# EAGLE board M18BR_V1_2 (EAGLE 7.4.0), part 1 of 2
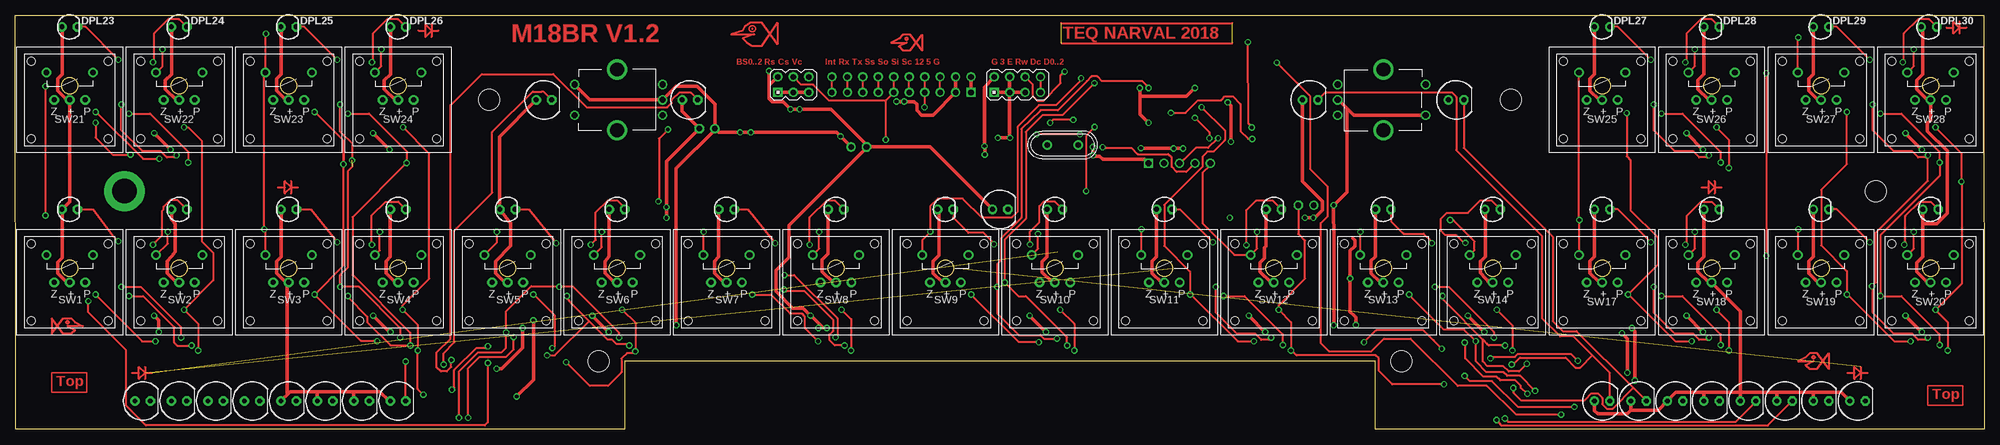
[diagram p3: board, top side]
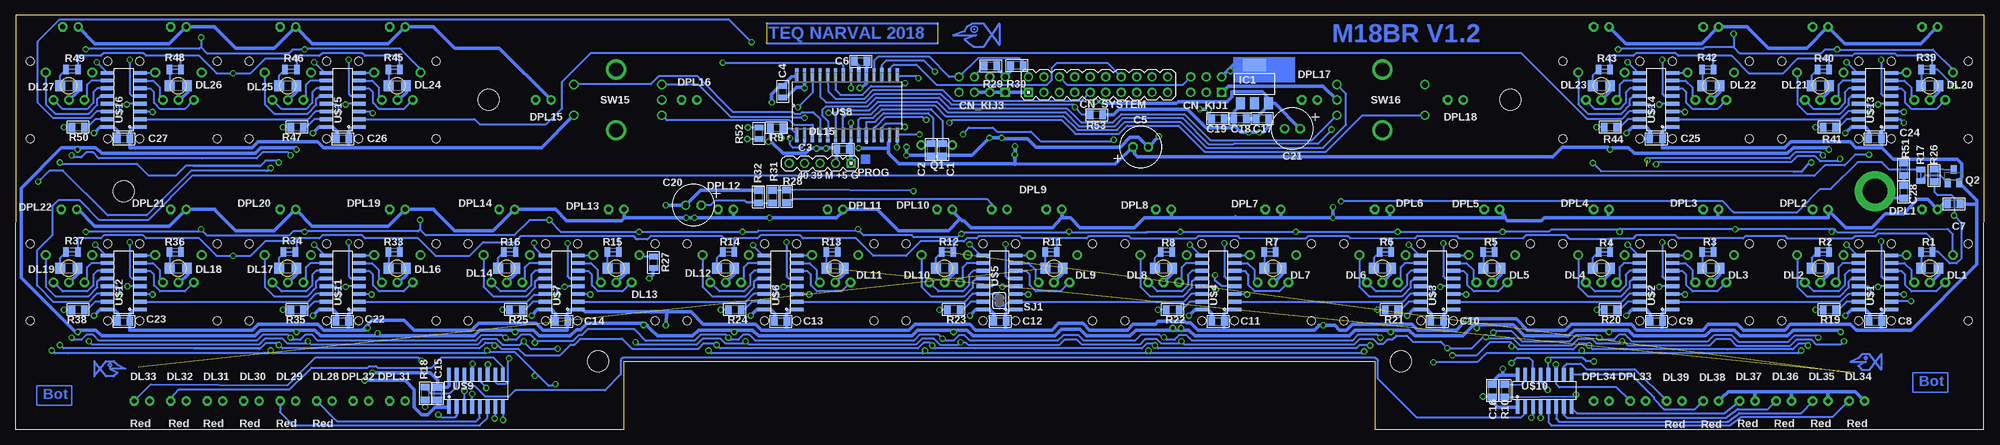
[diagram p4: board, bottom side, seen from below]

Size 323.81 x 68.11 mm. Coordinates in mm from the lower left corner, seen from the top.
Outline: 0,68.1 323.68,68.1 323.81,0 223.72,0 223.72,11.18 100.22,11.18 100.22,0 0.13,0 0,68.1
Outline: circle at 188.97,26.53 radius 1.33
Outline: circle at 170.97,26.53 radius 1.33
Outline: circle at 206.97,26.53 radius 1.33
Outline: circle at 224.97,26.53 radius 1.33
Outline: circle at 242.97,26.53 radius 1.33
Outline: circle at 152.97,26.53 radius 1.33
Outline: circle at 134.97,26.53 radius 1.33
Outline: circle at 116.97,26.53 radius 1.33
Outline: circle at 98.97,26.53 radius 1.33
Outline: circle at 80.97,26.53 radius 1.33
Outline: circle at 62.97,26.53 radius 1.33
Outline: circle at 44.97,26.53 radius 1.33
Outline: circle at 26.97,26.53 radius 1.33
Outline: circle at 8.97,26.53 radius 1.33
Outline: circle at 260.97,26.53 radius 1.33
Outline: circle at 278.97,26.53 radius 1.33
Outline: circle at 296.97,26.53 radius 1.33
Outline: circle at 314.97,26.53 radius 1.33
Outline: circle at 296.97,56.53 radius 1.33
Outline: circle at 8.97,56.53 radius 1.33
Copper layers (1*16): Top 0.035mm / dielectric 1.5mm / Bottom 0.035mm
Design rules "default *": minimum track width 10mil, minimum drill 23mil, track to track 12mil, track to pad 12mil, pad to pad 12mil, via to via 12mil, smd to smd 0mil, copper to edge 12mil, drill to drill 8mil, minimum pad ring 10mil, minimum via ring 8mil, stop-mask expansion 0mil, vias tented up to drill 0mil, thermal gap 10mil
Net classes: 0 default: width 0.305 mm, clearance 0.305 mm; 1 Tap: width 0.406 mm, clearance 0.305 mm
Holes 3.5 mm at 305.97,39.18 95.97,11.18 77.97,54.18 227.97,11.18 245.97,54.18
tRestrict: area 302.5,35.7 to 309.5,42.7; area 92.5,7.7 to 99.5,14.7; area 74.5,50.7 to 81.5,57.7; area 224.5,7.7 to 231.5,14.7; area 242.5,50.7 to 249.5,57.7
bRestrict: area 302.5,35.7 to 309.5,42.7; area 92.5,7.7 to 99.5,14.7; area 74.5,50.7 to 81.5,57.7; area 224.5,7.7 to 231.5,14.7; area 242.5,50.7 to 249.5,57.7

## Footprints (pad centres in the part's own frame; a part is rotated, then mirrored left to right if it is on the bottom)
R_0805_NAGY = smd 1.1 x 1.5: 1 -1.052,0; 2 1.052,0
R0805 = smd 0.9 x 1.5: 1 -0.953,0; 2 0.953,0
C_EL1RASZT07 = drill 0.914 pad 1.524 octagon: P+ 1.27,0 | drill 0.914 pad 1.524: P- -1.27,0
TESTCSAVAR = drill 4 pad 6.6: P$1 0,0
PIN03_2 = drill 0.914 pad 1.524 square: 1 -2.54,0 | drill 0.914 pad 1.524: 2 -2.54,2.54; 3 0,0; 4 0,2.54; 5 2.54,0; 6 2.54,2.54
PIN04_2 = drill 0.914 pad 1.524 square: 1 -2.54,0 | drill 0.914 pad 1.524: 2 -2.54,2.54; 3 0,0; 4 0,2.54; 5 2.54,0; 6 2.54,2.54; 7 5.08,0; 8 5.08,2.54
PIN10_2 = drill 0.914 pad 1.524 square: 1 -10.16,0 | drill 0.914 pad 1.524: 2 -10.16,2.54; 3 -7.62,0; 4 -7.62,2.54; 5 -5.08,0; 6 -5.08,2.54; 7 -2.54,0; 8 -2.54,2.54; 9 0,0; 10 0,2.54; 11 2.54,0; 12 2.54,2.54; 13 5.08,0; 14 5.08,2.54; 15 7.62,0; 16 7.62,2.54; 17 10.16,0; 18 10.16,2.54; 19 12.7,0; 20 12.7,2.54
R1206 = smd 1.6 x 1.803: 1 -1.422,0; 2 1.422,0
LED5MM = drill 0.813 pad 1.524: A -1.27,0 | drill 0.813 pad 1.524 octagon: K 1.27,0
LED3MM = drill 0.813 pad 1.524: A -1.27,0 | drill 0.813 pad 1.524 octagon: K 1.27,0
SOT223 = smd 1.5 x 2: 1 -2.3,-3.15; 2 0,-3.15; 3 2.3,-3.15 | smd 3.8 x 2: 4 0,3.15
PIN05_1 = drill 1.016 square: 1 -5.08,0 | drill 1.016: 2 -2.54,0; 3 0,0; 4 2.54,0; 5 5.08,0
XTAL_QS = drill 0.914 pad 1.524: 1 -2.54,0; 2 2.54,0
SOT23 = smd 1 x 1.4: 1 -0.95,-1.1; 2 0.95,-1.1; 3 0,1.1
R0805_C = smd 0.9 x 1.5: 1 -0.953,0; 2 0.953,0
SJ = smd 0.508 x 0.508: 1 -0.762,0; 2 0.762,0; 3 -0.762,0; 4 0.762,0
SPG2_3LED = drill 0.95 pad 1.6: G1 -3.81,4.5; G2 3.81,4.5 | drill 0.85 pad 1.6: LED+ 0,0; P- 2.54,0; Z- -2.54,0 | hole 1.35: 6.35,6.35; -6.35,6.35; -6.35,-6.35; 6.35,-6.35
ROTARY_ENC_SLIM = drill 1.016: A 7.493,-2.54; B 7.493,2.54; C 7.493,0; SW+ -6.985,2.54; SW- -6.985,-2.54 | drill 2.286: P$3 0,5; P$4 0,-5
SO16 = smd 0.6 x 2.2: 1 -4.445,-2.695; 2 -3.175,-2.695; 3 -1.905,-2.695; 4 -0.635,-2.695; 5 0.635,-2.695; 6 1.905,-2.695; 7 3.175,-2.695; 8 4.445,-2.695; 9 4.445,2.695; 10 3.175,2.695; 11 1.905,2.695; 12 0.635,2.695; 13 -0.635,2.695; 14 -1.905,2.695; 15 -3.175,2.695; 16 -4.445,2.695
SOIC28_NAGY = smd 2.381 x 0.533: 1 -4.899,8.255; 2 -4.899,6.985; 3 -4.899,5.715; 4 -4.899,4.445; 5 -4.899,3.175; 6 -4.899,1.905; 7 -4.899,0.635; 8 -4.899,-0.635; 9 -4.899,-1.905; 10 -4.899,-3.175; 11 -4.899,-4.445; 12 -4.899,-5.715; 13 -4.899,-6.985; 14 -4.899,-8.255; 15 4.899,-8.255; 16 4.899,-6.985; 17 4.999,-5.715; 18 4.899,-4.445; 19 4.899,-3.175; 20 4.899,-1.905; 21 4.899,-0.635; 22 4.899,0.635; 23 4.899,1.905; 24 4.899,3.175; 25 4.899,4.445; 26 4.899,5.715; 27 4.899,6.985; 28 4.899,8.255

## Placement (x,y rotation side)
C1  22  [R_0805_NAGY]  171.29,45.98 270 bottom
C2  22  [R_0805_NAGY]  173.2,45.98 270 bottom
C3  100n  [R_0805_NAGY]  187.64,46.04 0 bottom
C4  100n  [R0805]  197.64,55.5 270 bottom
C5  100u  [C_EL1RASZT07]  138.73,46.45 180 bottom
C6  1u  [R_0805_NAGY]  184.78,60.52 0 bottom
C7  100n  [R_0805_NAGY]  4.99,37.12 0 bottom
C8  100n  [R_0805_NAGY]  17.91,17.76 0 bottom
C9  100n  [R_0805_NAGY]  53.94,17.76 0 bottom
C10  100n  [R_0805_NAGY]  89.98,17.76 0 bottom
C11  100n  [R_0805_NAGY]  126.02,17.76 0 bottom
C12  100n  [R_0805_NAGY]  161.89,17.76 0 bottom
C13  100n  [R_0805_NAGY]  197.93,17.76 0 bottom
C14  100n  [R_0805_NAGY]  233.97,17.76 0 bottom
C15  100n  [R_0805_NAGY]  254.38,5.9 270 bottom
C16  100n  [R_0805_NAGY]  80.89,6.38 270 bottom
C17  100n  [R_0805_NAGY]  118.74,51.06 180 bottom
C18  10u  [R_0805_NAGY]  122.39,51.06 0 bottom
C19  100n  [R_0805_NAGY]  126.04,51.06 180 bottom
C20  220u  [C_EL1RASZT07]  212.28,36.86 0 bottom
C21  100u  [C_EL1RASZT07]  113.79,49.46 0 bottom
C22  100n  [R_0805_NAGY]  270.02,17.76 0 bottom
C23  100n  [R_0805_NAGY]  305.97,17.76 0 bottom
C24  100n  [R_0805_NAGY]  17.97,47.78 0 bottom
C25  100n  [R_0805_NAGY]  53.97,47.78 0 bottom
C26  100n  [R_0805_NAGY]  269.97,47.78 0 bottom
C27  100n  [R_0805_NAGY]  305.97,47.78 0 bottom
C28  100n  [R_0805_NAGY]  13.22,39.06 90 bottom
CN1  TESTCSAVAR  [TESTCSAVAR]  17.97,39.18 0 top
CN_KIJ1  Vc Cs Rs Bs2..0  [PIN03_2]  127.97,55.43 0 top
CN_KIJ3  D2..0 Dc Rw E 3 G  [PIN04_2]  163.53,55.43 0 top
CN_SYSTEM  Int Rx Tx Ss So Si Sc 12 5 G  [PIN10_2]  147.02,55.43 0 bottom
DL1  LED1206  [R1206]  8.97,26.53 180 bottom
DL2  LED1206  [R1206]  26.97,26.53 180 bottom
DL3  LED1206  [R1206]  44.97,26.53 180 bottom
DL4  LED1206  [R1206]  62.97,26.53 180 bottom
DL5  LED1206  [R1206]  80.97,26.53 180 bottom
DL6  LED1206  [R1206]  98.97,26.53 180 bottom
DL7  LED1206  [R1206]  116.97,26.53 180 bottom
DL8  LED1206  [R1206]  134.97,26.53 180 bottom
DL9  LED1206  [R1206]  152.97,26.53 180 bottom
DL10  LED1206  [R1206]  170.97,26.53 180 bottom
DL11  LED1206  [R1206]  188.97,26.53 180 bottom
DL12  LED1206  [R1206]  206.97,26.53 180 bottom
DL13  LED1206  [R1206]  224.97,26.53 180 bottom
DL14  LED1206  [R1206]  242.97,26.53 180 bottom
DL15  PWR  [LED5MM]  161.97,36.18 0 top
DL16  LED1206  [R1206]  260.97,26.53 180 bottom
DL17  LED1206  [R1206]  278.97,26.53 180 bottom
DL18  LED1206  [R1206]  296.97,26.53 180 bottom
DL19  LED1206  [R1206]  314.97,26.53 180 bottom
DL20  LED1206  [R1206]  8.97,56.53 180 bottom
DL21  LED1206  [R1206]  26.97,56.53 180 bottom
DL22  LED1206  [R1206]  44.97,56.53 180 bottom
DL23  LED1206  [R1206]  62.97,56.53 180 bottom
DL24  LED1206  [R1206]  260.97,56.53 180 bottom
DL25  LED1206  [R1206]  278.97,56.53 180 bottom
DL26  LED1206  [R1206]  296.97,56.53 180 bottom
DL27  LED1206  [R1206]  314.97,56.53 180 bottom
DL28  Red  [LED5MM]  272.97,4.68 0 top
DL29  Red  [LED5MM]  278.97,4.68 0 top
DL30  Red  [LED5MM]  284.97,4.68 0 top
DL31  Red  [LED5MM]  290.97,4.68 0 top
DL32  Red  [LED5MM]  296.97,4.68 0 top
DL33  Red  [LED5MM]  302.97,4.68 0 top
DL34  Red  [LED5MM]  20.97,4.68 0 top
DL35  Red  [LED5MM]  26.97,4.68 0 top
DL36  Red  [LED5MM]  32.97,4.68 0 top
DL37  Red  [LED5MM]  38.97,4.68 0 top
DL38  Red  [LED5MM]  44.97,4.68 0 top
DL39  Red  [LED5MM]  50.97,4.68 0 top
DPL1  LED3MM  [LED3MM]  8.97,36.18 0 top
DPL2  LED3MM  [LED3MM]  26.97,36.18 0 top
DPL3  LED3MM  [LED3MM]  44.97,36.18 0 top
DPL4  LED3MM  [LED3MM]  62.97,36.18 0 top
DPL5  LED3MM  [LED3MM]  80.97,36.18 0 top
DPL6  LED3MM  [LED3MM]  98.97,36.18 0 top
DPL7  LED3MM  [LED3MM]  116.97,36.18 0 top
DPL8  LED3MM  [LED3MM]  134.97,36.18 0 top
DPL9  LED3MM  [LED3MM]  152.97,36.18 0 top
DPL10  LED3MM  [LED3MM]  170.97,36.18 0 top
DPL11  LED3MM  [LED3MM]  188.97,36.18 0 top
DPL12  LED3MM  [LED3MM]  206.97,36.18 0 top
DPL13  LED3MM  [LED3MM]  224.97,36.18 0 top
DPL14  LED3MM  [LED3MM]  242.97,36.18 0 top
DPL15  LED5MM  [LED5MM]  236.97,54.18 0 top
DPL16  LED5MM  [LED5MM]  212.97,54.18 0 top
DPL17  LED5MM  [LED5MM]  110.97,54.18 0 top
DPL18  LED5MM  [LED5MM]  86.97,54.18 0 top
DPL19  LED3MM  [LED3MM]  260.97,36.18 0 top
DPL20  LED3MM  [LED3MM]  278.97,36.18 0 top
DPL21  LED3MM  [LED3MM]  296.97,36.18 0 top
DPL22  LED3MM  [LED3MM]  314.97,36.18 0 top
DPL23  LED3MM  [LED3MM]  8.97,66.18 0 top
DPL24  LED3MM  [LED3MM]  26.97,66.18 0 top
DPL25  LED3MM  [LED3MM]  44.97,66.18 0 top
DPL26  LED3MM  [LED3MM]  62.97,66.18 0 top
DPL27  LED3MM  [LED3MM]  260.97,66.18 0 top
DPL28  LED3MM  [LED3MM]  278.97,66.18 0 top
DPL29  LED3MM  [LED3MM]  296.97,66.18 0 top
DPL30  LED3MM  [LED3MM]  314.72,66.18 0 top
DPL31  LED5MM  [LED5MM]  260.97,4.68 0 top
DPL32  LED5MM  [LED5MM]  266.97,4.68 0 top
DPL33  LED5MM  [LED5MM]  56.97,4.68 0 top
DPL34  LED5MM  [LED5MM]  62.97,4.68 0 top
IC1  LD117AS33TR  [SOT223]  120.01,56.77 0 bottom
PROG  40 39 M +5 G  [PIN05_1]  191.45,43.75 180 bottom
Q1  20MHz  [XTAL_QS]  172.27,46.77 180 top
Q2  BC846BSMD  [SOT23]  5.05,41.62 0 bottom
R1  [R0805_C]  9.47,29.18 0 bottom
R2  [R0805_C]  26.47,29.18 180 bottom
R3  [R0805_C]  45.47,29.18 0 bottom
R4  [R0805_C]  62.47,29.18 180 bottom
R5  [R0805_C]  81.47,29.18 0 bottom
R6  [R0805_C]  98.47,29.18 180 bottom
R7  [R0805_C]  117.47,29.18 0 bottom
R8  [R0805_C]  134.47,29.18 180 bottom
R9  1k  [R_0805_NAGY]  198.61,49.57 180 bottom
R10  33  [R_0805_NAGY]  78.82,6.38 270 bottom
R11  [R0805_C]  153.47,29.18 0 bottom
R12  [R0805_C]  170.47,29.18 180 bottom
R13  [R0805_C]  189.47,29.18 0 bottom
R14  [R0805_C]  206.47,29.18 180 bottom
R15  [R0805_C]  225.47,29.18 0 bottom
R16  [R0805_C]  242.47,29.18 180 bottom
R17  [R0805_C]  10.45,41.78 270 bottom
R18  33  [R_0805_NAGY]  256.41,5.91 270 bottom
R19  [R_0805_NAGY]  25.47,19.68 180 bottom
R20  [R_0805_NAGY]  61.47,19.68 180 bottom
R21  [R_0805_NAGY]  97.47,19.68 180 bottom
R22  [R_0805_NAGY]  133.47,19.68 180 bottom
R23  [R_0805_NAGY]  169.47,19.68 180 bottom
R24  [R_0805_NAGY]  205.47,19.68 180 bottom
R25  [R_0805_NAGY]  241.47,19.68 180 bottom
R26  [R_0805_NAGY]  8.22,41.78 90 bottom
R27  2.2k  [R0805]  218.82,27.46 90 bottom
R28  10k  [R_0805_NAGY]  196.97,38.32 90 bottom
R29  2.2k  [R_0805_NAGY]  163.43,59.82 0 bottom
R30  2.2k  [R_0805_NAGY]  159.07,59.82 180 bottom
R31  330  [R_0805_NAGY]  199.25,38.26 270 bottom
R32  150  [R_0805_NAGY]  201.55,38.26 90 bottom
R33  [R0805_C]  261.47,29.18 0 bottom
R34  [R0805_C]  278.72,29.18 180 bottom
R35  [R_0805_NAGY]  277.47,19.68 180 bottom
R36  [R0805_C]  297.47,29.18 0 bottom
R37  [R0805_C]  314.47,29.18 180 bottom
R38  [R_0805_NAGY]  313.47,19.68 180 bottom
R39  [R0805_C]  9.47,59.18 0 bottom
R40  [R0805_C]  26.47,59.18 180 bottom
R41  [R_0805_NAGY]  25.47,49.68 180 bottom
R42  [R0805_C]  45.47,59.18 0 bottom
R43  [R0805_C]  62.47,59.18 180 bottom
R44  [R_0805_NAGY]  61.47,49.68 180 bottom
R45  [R0805_C]  261.47,59.18 0 bottom
R46  [R0805_C]  278.47,59.18 180 bottom
R47  [R_0805_NAGY]  277.47,49.68 180 bottom
R48  [R0805_C]  297.47,59.18 0 bottom
R49  [R0805_C]  314.47,59.18 180 bottom
R50  [R_0805_NAGY]  313.47,49.68 180 bottom
R51  10k  [R_0805_NAGY]  13.22,42.81 90 bottom
R52  2.2k  [R0805]  201.5,48.71 90 bottom
R53  220  [R_0805_NAGY]  146,51.76 0 bottom
SJ1  [SJ]  161.97,21.18 90 bottom
SW1  SPG2  [SPG2_3LED]  8.97,24.18 0 top
SW2  SPG2  [SPG2_3LED]  26.97,24.18 0 top
SW3  SPG2  [SPG2_3LED]  44.97,24.18 0 top
SW4  SPG2  [SPG2_3LED]  62.97,24.18 0 top
SW5  SPG2  [SPG2_3LED]  80.97,24.18 0 top
SW6  SPG2  [SPG2_3LED]  98.97,24.18 0 top
SW7  SPG2  [SPG2_3LED]  116.97,24.18 0 top
SW8  SPG2  [SPG2_3LED]  134.97,24.18 0 top
SW9  SPG2  [SPG2_3LED]  152.97,24.18 0 top
SW10  SPG2  [SPG2_3LED]  170.97,24.18 0 top
SW11  SPG2  [SPG2_3LED]  188.97,24.18 0 top
SW12  SPG2  [SPG2_3LED]  206.97,24.18 0 top
SW13  SPG2  [SPG2_3LED]  224.97,24.18 0 top
SW14  SPG2  [SPG2_3LED]  242.97,24.18 0 top
SW15  ROTARTY_ENCODERSLIM  [ROTARY_ENC_SLIM]  224.97,54.18 180 top
SW16  ROTARTY_ENCODERSLIM  [ROTARY_ENC_SLIM]  98.97,54.18 0 top
SW17  SPG2  [SPG2_3LED]  260.97,24.18 0 top
SW18  SPG2  [SPG2_3LED]  278.97,24.18 0 top
SW19  SPG2  [SPG2_3LED]  296.97,24.18 0 top
SW20  SPG2  [SPG2_3LED]  314.97,24.18 0 top
SW21  SPG2  [SPG2_3LED]  8.97,54.18 0 top
SW22  SPG2  [SPG2_3LED]  26.97,54.18 0 top
SW23  SPG2  [SPG2_3LED]  44.97,54.18 0 top
SW24  SPG2  [SPG2_3LED]  62.97,54.18 0 top
SW25  SPG2  [SPG2_3LED]  260.97,54.18 0 top
SW26  SPG2  [SPG2_3LED]  278.97,54.18 0 top
SW27  SPG2  [SPG2_3LED]  296.97,54.18 0 top
SW28  SPG2  [SPG2_3LED]  314.97,54.18 0 top
U$1  SCT2168SOP16  [SO16]  17.97,24.18 90 bottom
U$2  SCT2168SOP16  [SO16]  53.97,24.18 90 bottom
U$3  SCT2168SOP16  [SO16]  89.97,24.18 90 bottom
U$4  SCT2168SOP16  [SO16]  125.97,24.18 90 bottom
U$5  SCT2168SOP16  [SO16]  161.97,24.18 90 bottom
U$6  SCT2168SOP16  [SO16]  197.97,24.18 90 bottom
U$7  SCT2168SOP16  [SO16]  233.97,24.18 90 bottom
U$8  PIC32MX1XXSOIC_NAGY  [SOIC28_NAGY]  187.01,53.28 90 bottom
U$9  SCT2168SOP16  [SO16]  248.03,6.38 0 bottom
U$10  SCT2168SOP16  [SO16]  72.31,6.38 0 bottom
U$11  SCT2168SOP16  [SO16]  269.97,24.18 90 bottom
U$12  SCT2168SOP16  [SO16]  305.97,24.18 90 bottom
U$13  SCT2168SOP16  [SO16]  17.97,54.18 90 bottom
U$14  SCT2168SOP16  [SO16]  53.97,54.18 90 bottom
U$15  SCT2168SOP16  [SO16]  269.97,54.18 90 bottom
U$16  SCT2168SOP16  [SO16]  305.97,54.18 90 bottom

## Tracks (layer width: path | path; a pad name or v marks a point on that pad's centre or on a via)
+3V3  (via drill 0.6, 0.61)
  Top 0.61: C5.P+ 140,46.7 | 123.98,56.61 123.98,54.39 124.46,53.92 126.23,53.92 v127.5,52.64 v129,52.64 134.14,52.64 140.09,46.7 140.09,46.55 | 123.98,56.61 125.34,57.97 CN_KIJ1.2 | v199.91,47.29 199.93,50.73 199.93,53.25 v199.39,53.78 | v185.13,46.26 190.44,46.26 v190.5,46.2 v192.06,46.2 | CN_KIJ3.2 160.99,57.9 159.38,56.3 v159.38,46.58 | v23.62,16.02 23.62,17.92 v22.83,18.71 | v58.86,18.71 61.56,16.02 v61.72,16.02 | v94.9,18.71 v97.6,16.02 | v130.78,18.71 130.76,18.7 130.92,18.59 132.73,16.76 132.17,16.76 v132.09,16.68 v133.47,16.68 | v166.81,18.71 v169.51,16.02 | v202.85,18.71 v205.55,16.02 | v238.89,18.71 v241.59,16.02 | 219.99,31.42 220.31,31.1 220.31,30.14 219.52,29.35 219.52,24.93 | v220.47,17.17 220.47,18.44 220.22,18.68 219.52,19.37 v219.52,24.84 219.52,24.93 | 219.52,24.93 219.52,24.82 | 140.09,46.55 140.09,46.43 127.22,33.56 127.22,28.31 125.09,26.18 125.09,22.68 127.84,19.93 129.59,19.93 130.72,18.81 130.72,18.78 v130.78,18.71 | v274.85,18.71 v277.55,16.02 | v310.85,18.71 v313.55,16.02 | v274.85,48.71 v277.55,46.02 | v310.85,48.71 v313.55,46.02 | v22.85,48.71 v25.55,46.02 | v58.85,48.71 v61.55,46.02 | v79.16,9.98 80.02,9.99 83.47,13.43 v83.47,16.68 83.45,16.68 | v123.97,58.93 123.97,56.68 123.98,56.67 123.98,56.61 | 130.78,18.75 v130.78,18.71 | v265.09,9.31 265.09,14.93 v264.22,15.81 | C5.P+ 150.45,46.45 160.72,36.18 DL15.A | 140.09,46.55 C5.P+ | v159.45,45.18 159.47,46.31
  Bottom 0.305: U$3.16 91.64,19.74 | 163.55,19.74 U$5.16
  Bottom 0.61: IC1.4 123.48,59.92 123.5,59.95 123.51,59.95 125.43,58.03 CN_KIJ1.2 | v129,52.64 v127.5,52.64 127.57,51.06 C19.2 | PROG.2 188.72,43.95 C3.1 188.93,46.28 188.93,46.3 190.34,46.29 v190.5,46.2 v192.06,46.2 193.07,46.2 193.85,45.42 197.57,45.42 199.39,47.25 | 199.39,47.25 199.86,47.25 199.87,47.25 v199.91,47.29 | U$8.28 196.12,57.98 C4.1 198.12,56.46 198.12,56.4 199.39,55.13 v199.39,53.78 | U$8.13 180.02,47.41 180.18,47.25 180.18,46.26 | 180.18,46.26 180.18,45.41 179.39,44.61 178.5,43.69 178.36,43.68 159.43,43.68 v159.45,45.18 159.34,46.43 | 180.18,46.26 v185.13,46.26 | C8.1 18.86,19.03 19.56,19.74 U$1.16 21.81,19.74 v22.83,18.71 | C9.1 54.9,19.03 55.6,19.74 U$2.16 57.84,19.74 v58.86,18.71 | C10.1 90.93,19.03 91.64,19.74 | C11.1 126.97,19.03 127.67,19.74 U$4.16 129.76,19.74 v130.78,18.71 | C12.1 162.85,19.03 163.55,19.74 | C13.1 198.88,19.03 199.59,19.74 U$6.16 201.83,19.74 v202.85,18.71 | C14.1 234.92,19.03 235.62,19.74 U$7.16 237.87,19.74 v238.89,18.71 | 61.72,16.33 58.55,16.33 57.59,15.38 45.85,15.38 44.9,16.33 41.08,16.33 40.13,15.38 32.35,15.38 31.4,16.33 23.62,16.33 v23.62,16.02 | 61.72,16.33 67.44,16.33 68.39,15.38 75.67,15.38 77.47,17.18 83.47,17.18 | 83.47,17.18 83.97,17.18 85.77,15.38 93.63,15.38 94.58,16.33 97.6,16.33 | 97.6,16.33 103.47,16.33 104.43,15.38 129.83,15.38 130.78,16.33 133.32,16.33 | 133.32,16.33 133.47,16.33 | 133.47,16.33 139.51,16.33 140.46,15.38 147.61,15.38 148.72,16.49 151.73,16.49 152.84,15.38 166.34,15.38 167.29,16.33 169.51,16.33 | 169.51,16.33 175.39,16.33 176.34,15.38 201.58,15.38 202.53,16.33 205.55,16.33 | 205.55,16.33 211.42,16.33 212.38,15.38 218.18,15.38 219.29,16.49 220.22,17.49
  Bottom 0.61: 220.22,17.49 229.78,17.49 230.84,16.43 231.47,16.43 232.52,15.38 237.63,15.38 238.58,16.33 241.27,16.33 v241.59,16.02 241.74,16.02 242.06,16.33 247.43,16.33 248.38,15.38 264.59,15.38 | v61.72,16.02 61.72,16.33 | U$3.16 93.88,19.74 v94.9,18.71 | v97.6,16.02 97.6,16.33 | 132.86,16.33 133.32,16.33 | U$5.16 165.79,19.74 v166.81,18.71 | v169.51,16.02 169.51,16.33 | v205.55,16.02 205.55,16.33 | U$9.16 252.48,7.18 252.73,6.93 254.34,6.93 | v220.47,17.17 220.22,17.49 | C16.1 80.85,7.44 80.85,7.82 79.81,8.92 79.22,8.92 | 79.22,8.92 76.76,8.92 U$10.16 | R27.1 218.88,26.51 218.9,25.44 v219.52,24.84 | R29.2 162.48,59.49 160.99,58 | 160.99,58 160.94,57.95 | R30.2 160.03,58.93 CN_KIJ3.2 160.99,58 | 270.88,17.76 270.88,17.93 | 270.88,17.93 270.88,19.03 271.59,19.74 U$11.16 273.83,19.74 v274.85,18.71 | 264.59,15.38 273.58,15.38 274.53,16.33 277.55,16.33 | 277.55,16.33 283.42,16.33 284.38,15.38 | v277.55,16.02 277.55,16.33 | 284.38,15.38 309.58,15.38 310.53,16.33 313.17,16.33 313.49,16.02 v313.55,16.02 313.59,16.06 313.97,16.06 322.84,24.93 322.84,39.68 316.22,46.31 313.72,46.31 313.72,45.93 313.59,46.06 v313.55,46.02 313.55,46.33 310.53,46.33 309.58,45.38 284.38,45.38 | v310.85,18.71 309.83,19.74 U$12.16 307.59,19.74 306.88,19.03 306.88,17.76 C23.1 | 284.38,15.38 283.43,16.33 278.06,16.33 | 284.38,45.38 283.42,46.33 277.55,46.33 v277.55,46.02 | v274.85,48.71 273.83,49.74 U$15.16 271.59,49.74 270.88,49.03 270.88,47.76 270.9,47.76 C26.1 | v310.85,48.71 309.83,49.74 U$16.16 307.59,49.74 306.88,49.03 306.88,47.76 306.9,47.76 C27.1 | 284.38,45.38 283.43,46.33 278.06,46.33 | 18.88,47.76 18.88,47.93
  Bottom 0.61: 18.88,47.93 18.88,49.03 19.59,49.74 U$13.16 21.83,49.74 v22.85,48.71 | 32.38,45.38 31.42,46.33 25.55,46.33 v25.55,46.02 | 32.38,45.38 57.58,45.38 58.53,46.33 61.19,46.33 61.51,46.02 v61.55,46.02 | v58.85,48.71 57.83,49.74 U$14.16 55.59,49.74 54.88,49.03 54.88,47.76 54.9,47.76 C25.1 | 32.38,45.38 31.43,46.33 26.06,46.33 | C24.1 18.92,47.89 18.88,47.93 | C22.1 270.98,17.84 270.88,17.93 | v83.47,16.68 83.47,17.18 | v79.16,9.98 79.16,8.99 79.22,8.93 79.22,8.92 | v61.55,46.02 61.84,46.31 | 159.34,46.43 159.37,43.64 142.84,43.66 C5.P+ 139.97,46.48 139.97,46.56 139.84,46.56 139.72,46.43 139.72,45.31 139.22,44.81 70.97,44.81 69.38,46.39 61.92,46.39 v61.55,46.02 | C15.1 254.34,6.89 254.34,6.93 | 254.34,6.93 254.34,8.06 255.59,9.31 v265.09,9.31 | v132.09,16.68 132.09,16.43 | v133.47,16.68 133.47,16.33 | v123.97,58.93 124.22,59.18 | 159.34,46.43 159.34,46.56 159.37,46.58 v159.38,46.58 | v264.22,15.81 264.59,15.43 264.59,15.38 | R9.2 199.6,49.53 199.6,47.44 199.59,47.44 199.39,47.25
+5V  (via drill 0.6, 0.61)  (2 unrouted)
  Top 0.61: CN_SYSTEM.4 CN_SYSTEM.3 150.9,51.69 149.07,51.69 148.27,52.49 148.27,53.44 147.8,53.92 v146.21,53.92 v144.94,53.92 | 277.55,6.11 273.11,6.11 271.7,4.7 DL28.A 270.2,3.18 265.72,3.18 | 277.55,6.11 283.59,6.11 | 283.59,6.11 289.62,6.11 | 289.62,6.11 295.65,6.11 | 295.65,6.11 300.27,6.11 DL33.A | DL32.A 295.7,6.06 295.65,6.11 | DL31.A 289.7,6.03 289.62,6.11 | DL30.A 283.7,5.99 | 283.7,5.99 283.59,6.11 | DL29.A 277.7,5.96 277.55,6.11 | DPL2.A 25.7,34.47 26.32,33.84 26.32,29.19 25.7,28.45 24.97,27.68 24.97,25.68 26.47,24.18 SW2.LED+ | SW4.LED+ 62.47,24.18 60.97,25.68 60.97,27.68 61.7,28.41 DPL4.A | DPL6.A 97.7,28.45 96.97,27.68 96.97,25.68 98.47,24.18 SW6.LED+ | SW8.LED+ 134.47,24.18 132.7,25.95 132.7,27.91 133.7,28.91 DPL8.A | DPL12.A 205.71,30.14 205.47,29.9 205.47,28.18 204.7,27.41 204.7,25.95 206.47,24.18 SW12.LED+ | DPL13.A 223.7,28.43 222.97,27.7 222.97,25.68 224.47,24.18 SW13.LED+ | DPL11.A 187.7,28.41 186.97,27.68 186.97,25.68 188.47,24.18 SW11.LED+ | DPL9.A 151.89,35.99 151.89,28.61 150.97,27.68 150.97,25.68 152.47,24.18 SW9.LED+ | DPL7.A 115.7,28.41 114.97,27.68 114.97,25.68 116.47,24.18 SW7.LED+ | SW5.LED+ 80.47,24.18 78.97,25.68 78.97,27.68 81.45,30.16 81.45,33.96 81.41,34 DPL5.A 79.66,36.22 79.66,48.15 DPL18.A | DPL3.A 43.7,28.41 42.97,27.68 42.97,25.68 44.47,24.18 44.72,24.18 | 44.72,24.18 SW3.LED+ | SW1.LED+ 8.47,24.18 6.97,25.68 6.97,27.46 7.75,28.24 DPL1.A 8.97,37.45 SW21.LED+ 8.47,54.18 6.97,55.68 6.97,57.68 7.72,58.43 7.7,58.45 DPL23.A | DPL10.A 169.7,28.42 168.88,27.6 168.88,25.86 170.49,24.25 170.49,24.16 170.51,24.18 SW10.LED+ | DPL20.A 277.71,30.14 277.72,30.15 277.72,28.43 276.7,27.41 276.7,25.95 278.47,24.18 SW18.LED+ 278.97,24.12 283.7,19.39 283.7,5.99
  Top 0.61: DPL19.A 259.7,28.41 258.97,27.68 258.97,25.68 260.47,24.18 SW17.LED+ | 313.7,33.56 313.7,33.81 314.95,33.81 315.97,33.81 317.72,35.56 317.72,45.81 314.47,49.06 314.47,50.31 314.97,50.81 SW28.LED+ 314.47,54.18 312.7,55.95 312.7,57.41 313.72,58.43 313.72,60.15 313.71,60.14 313.71,65.92 DPL30.A | 313.7,33.56 313.71,30.14 313.72,30.15 313.72,28.43 312.7,27.41 312.7,25.95 314.47,24.18 SW20.LED+ | SW19.LED+ 296.47,24.18 294.97,25.68 294.97,27.68 295.7,28.41 DPL21.A | SW22.LED+ 26.47,54.18 24.7,55.95 24.7,57.41 25.72,58.43 25.72,60.15 25.71,60.14 DPL24.A | SW24.LED+ 62.47,54.18 60.7,55.95 60.7,57.41 61.72,58.43 61.72,60.15 61.71,60.14 DPL26.A | SW23.LED+ 44.47,54.18 42.97,55.68 42.97,57.68 43.7,58.41 DPL25.A | SW26.LED+ 278.47,54.18 276.7,55.95 276.7,57.41 277.72,58.43 277.72,60.15 277.71,60.14 277.71,66.17 DPL28.A | SW25.LED+ 260.47,54.18 258.97,55.68 258.97,57.68 259.7,58.41 DPL27.A | SW27.LED+ 296.47,54.18 294.97,55.68 294.97,57.68 295.7,58.41 DPL29.A | 44.72,24.18 44.72,5.7 | 44.72,5.7 DL38.A | DPL34.A 61.47,4.68 59.97,6.18 55.72,6.18 | 55.72,6.18 49.72,6.18 | 49.72,6.18 45.22,6.18 44.72,5.68 44.72,5.7 | DL39.A 49.7,6.16 49.72,6.18 | DPL33.A 55.7,6.16 55.72,6.18 | DPL17.A 109.7,52.28 C21.P+ 112.49,49.46 107.09,44.06 v107.09,36.56 v107.09,34.8 | DPL16.A 211.7,40.83 214.97,37.56 214.97,36.05 213.72,34.8 v213.48,34.8 | DPL22.A 313.7,33.56 | 265.72,3.18 265.09,2.56 260.22,2.56 259.72,3.06 259.7,3.06 DPL31.A | DPL32.A 265.7,3.2 265.72,3.18 | DPL14.A 241.74,36.14 241.74,28.4 241.04,27.69 240.97,27.69 240.97,25.75 242.51,24.07 242.86,24.07 SW14.LED+ | v213.48,34.8 v213.47,34.81
  Top 0.61: v213.48,34.8 212.1,34.8 v212.09,34.81
  Bottom 0.305: DL1.1 7.47,26.6 | DL3.1 43.47,26.6 | DL5.1 79.47,26.6 | DL7.1 115.47,26.6 | 25.53,26.65 25.53,26.66 DL2.1 | DL16.1 259.47,26.6 | DL18.1 295.47,26.6 | DL20.1 7.47,56.6 | DL22.1 43.47,56.6 | DL24.1 259.47,56.6 | DL26.1 295.47,56.6 | 278.98,24.11 278.98,24.17 SW18.LED+
  Bottom 0.61: IC1.3 117.32,53.39 | C18.2 C17.2 119.69,51.24 117.77,53.16 | IC1.3 117.71,53.15 117.71,53.26 117.77,53.16 | v146.21,53.92 v144.94,53.92 144.46,53.6 132.87,53.6 132.56,53.92 124.53,53.92 | IC1.3 117.71,54.47 118.74,55.5 123.72,55.5 123.76,55.46 123.76,54.69 124.53,53.92 | DPL9.A 151.7,34.83 151.73,34.8 | 7.47,26.6 7.47,25.86 | 7.47,25.86 7.47,25.43 8.72,24.18 SW1.LED+ | 43.47,26.6 43.47,25.43 44.72,24.18 SW3.LED+ | 79.47,26.6 79.47,25.43 80.72,24.18 SW5.LED+ | 115.47,26.6 115.47,25.43 116.72,24.18 SW7.LED+ | 223.7,34.75 224.12,34.32 233.17,34.32 234.92,36.22 241.66,36.22 DPL14.A 245.2,32.68 245.97,32.68 245.97,32.69 251.52,32.69 254.9,36.07 254.9,36.11 254.97,36.18 DPL19.A 259.72,36.18 262.47,33.43 274.97,33.43 277.7,36.16 | 205.71,34.8 v199.74,34.8 188.72,34.8 187.61,35.91 187.61,36.22 | 151.73,34.8 153.21,33.16 166.61,33.16 167.77,34.32 168.09,34.32 168.4,34.64 | 151.73,34.8 150.31,34.8 148.67,33.16 139.72,33.16 138.08,34.8 133.79,34.8 | 133.79,34.8 123.16,34.8 | 123.16,34.8 115.7,34.8 | 115.7,34.8 v107.09,34.8 | v107.09,34.8 97.76,34.8 | 97.76,34.8 81.41,34.8 | 61.88,34.8 72.36,34.8 72.84,34.32 78.39,34.32 78.87,34.8 81.41,34.8 | 61.88,34.8 43.78,34.8 | 43.78,34.8 25.69,34.8 25.69,36.07 | 25.69,36.07 22.78,33.16 18.54,33.16 16.27,35.43 13.22,35.43 11.02,37.81 9.33,37.81 7.75,36.22 7.74,36.22 DPL1.A 6.7,37.18 5.97,37.18 5.94,37.16 C7.1 | DPL3.A 43.7,35.84 43.78,34.8 | DPL6.A 97.7,35.97 97.76,34.8 | DPL7.A 115.7,34.8 | DPL8.A 133.7,34.89 133.79,34.8 | DPL12.A 205.7,35.9 205.71,34.8 | DPL13.A 223.7,34.75 | 223.7,34.75 223.65,34.8 v212.09,34.8 v212.09,34.81 v212.08,34.8 205.71,34.8
  Bottom 0.61: DPL5.A 78.87,34.87 81.41,34.8 | DPL4.A 61.72,36.18 61.88,34.8 | 187.61,36.22 182.06,36.22 178.52,32.69 170.35,32.69 168.4,34.64 | 25.69,36.07 25.69,36.22 25.7,36.21 DPL2.A | DPL10.A 169.7,35.93 169.67,35.91 | 168.4,34.64 169.67,35.91 | 169.67,35.91 169.67,36.07 | 123.16,34.96 123.16,34.8 | 37.57,6.2 42.11,6.2 42.2,6.11 DL38.A | 37.57,6.2 31.56,6.2 | 31.56,6.2 25.84,6.2 | 25.84,6.2 21.24,6.2 19.73,4.69 | 19.73,4.69 19.65,4.61 | DL35.A 25.7,6.05 25.84,6.2 | DL36.A 31.7,6.05 31.56,6.2 | DL37.A 37.7,5.83 37.57,6.2 | 7.15,26.18 7.47,25.86 | SW2.LED+ 25.53,25.62 25.53,26.65 | DL4.1 61.55,25.6 SW4.LED+ | DL6.1 97.55,25.6 SW6.LED+ | DL8.1 133.55,25.6 SW8.LED+ | DL34.A 19.73,4.69 | 187.61,36.22 187.66,36.22 DPL11.A | 124.46,53.92 124.53,53.92 | 124.53,53.92 124.54,53.91 | 117.77,53.16 117.73,53.35 | 259.47,26.6 259.47,25.43 260.72,24.18 SW17.LED+ | DL17.1 277.55,25.55 278.98,24.11 | 295.47,26.6 295.47,25.43 296.72,24.18 SW19.LED+ | DL19.1 313.55,25.55 314.97,24.12 | 314.98,24.11 314.97,24.12 | 314.97,24.12 SW20.LED+ | 277.7,36.16 277.72,36.18 281.21,32.69 287.52,32.69 290.9,36.07 290.9,36.11 290.97,36.18 DPL21.A 295.72,36.18 298.47,33.43 310.72,33.43 313.47,36.18 DPL22.A | 7.47,56.6 7.47,55.43 8.72,54.18 SW21.LED+ | DL21.1 25.55,55.55 26.97,54.12 | 26.98,54.11 26.97,54.12 | 26.97,54.12 SW22.LED+ | 43.47,56.6 43.47,55.43 44.72,54.18 SW23.LED+ | DL23.1 61.55,55.55 62.97,54.12 | 62.98,54.11 62.97,54.12 | 62.97,54.12 SW24.LED+ | 25.72,66.18 29.21,62.69 35.52,62.69 38.9,66.07 38.9,66.11 38.97,66.18 DPL25.A 43.72,66.18 46.47,63.43 58.97,63.43 61.72,66.18 DPL26.A 61.47,66.18 | 259.47,56.6 259.47,55.43 260.72,54.18 SW25.LED+
  Bottom 0.61: DL25.1 277.55,55.55 278.97,54.12 | 278.98,54.11 278.97,54.12 | 278.97,54.12 SW26.LED+ | 295.47,56.6 295.47,55.43 296.72,54.18 SW27.LED+ | DL27.1 313.55,55.55 314.97,54.12 SW28.LED+ | 277.72,66.18 281.21,62.69 287.52,62.69 290.9,66.07 290.9,66.11 290.97,66.18 DPL29.A 295.72,66.18 298.47,63.43 310.72,63.43 313.47,66.18 DPL30.A | 277.72,66.18 274.97,63.43 262.47,63.43 259.72,66.18 DPL27.A 254.97,66.18 254.9,66.11 254.9,66.07 251.52,62.69 244.2,62.69 DPL15.A | 25.72,66.18 22.97,63.43 10.47,63.43 7.72,66.18 DPL23.A | DPL24.A 25.72,66.18 | v107.09,34.8 v107.09,36.56 | C21.P+ 116.69,53.62 IC1.3 | DPL20.A 277.7,36.16 | 277.72,66.18 DPL28.A | SW9.LED+ 151.66,25.49 151.66,26.49 | SW11.LED+ 187.55,25.6 DL11.1 | SW12.LED+ 205.55,25.6 DL12.1 | SW13.LED+ 223.55,25.6 DL13.1 | SW14.LED+ 241.55,25.6 DL14.1 | SW10.LED+ 169.44,25.71 169.44,26.49
+12V
  Top 0.305: CN_SYSTEM.5 152.1,55.49 152.08,55.5 152.08,58.04 152.1,58.03 CN_SYSTEM.6 152.08,57.96
  Bottom 0.305: CN_KIJ1.6 131.79,56.69 150.82,56.69 CN_SYSTEM.6
GND  (via drill 0.6, 0.61)
  Top 0.61: v216.82,17.13 216.82,32.73 216.77,34.89 216.77,36.86 v216.82,36.86 218.97,39.01 218.97,52.81 | 184.94,54.74 184.94,51.85 v186.37,50.42 | CN_SYSTEM.1 CN_SYSTEM.2 | 163.51,58.04 163.53,58.03 CN_KIJ3.4 CN_KIJ3.3 163.53,48 v163.59,47.93 v161.59,47.93 | CN_KIJ1.5 CN_KIJ1.3 CN_KIJ1.1 130.49,55.43 | C5.P- 135.9,48.04 135.11,48.84 v120.97,48.84 v119.22,48.84 115.68,48.84 C21.P- 115.06,49.65 115.09,49.68 | v82.47,5.43 85.22,8.18 v85.22,17.93 | v108.71,17.14 v108.72,17.15 108.72,42.93 115.09,49.31 115.09,49.68 | PROG.1 185.69,44.43 178.84,44.43 178.34,44.93 177.34,44.93 v177.22,45.06 v177.22,46.43 | 218.97,52.81 217.59,54.18 SW15.C | 218.97,52.81 220.13,51.64 SW15.SW+ | v266.34,8.06 266.34,16.18 v265.84,16.68 | 160.84,55.43 CN_KIJ3.5 | 115.09,49.68 115.09,53.43 112.09,56.43 108.72,56.43 106.97,54.68 106.96,54.68 SW16.C 94.47,54.18 91.97,56.68 91.97,56.71 SW16.SW+ | v193.99,56.14 192.6,54.74 184.94,54.74 | v184.94,56.14 184.94,54.74
  Bottom 0.61: 17.05,16.34 21.08,16.33 22.04,17.29 26.63,17.29 | 26.63,17.29 31.87,17.29 32.83,16.33 39.66,16.33 40.61,17.29 45.37,17.29 46.32,16.33 46.46,16.33 49.47,16.34 52.99,16.34 | 52.99,16.34 57.13,16.34 58.07,17.29 62.47,17.29 | 62.47,17.29 67.91,17.29 68.86,16.34 75.13,16.34 76.97,18.18 84.97,18.18 v85.22,17.93 86.81,16.34 88.87,16.34 | 88.87,16.34 93.16,16.33 94.11,17.29 103.95,17.29 104.9,16.33 106.01,16.33 106.81,17.13 106.81,17.17 107.28,17.14 v108.71,17.14 109.44,17.17 109.44,17.04 110.14,16.33 125.06,16.34 | 125.06,16.34 125.07,16.33 129.35,16.33 130.52,17.51 131.2,17.51 131.51,17.82 135.9,17.82 136.33,17.29 139.99,17.29 140.94,16.33 142.88,16.34 142.89,16.33 147.13,16.33 148.24,17.44 152.21,17.44 153.32,16.33 160.94,16.33 | 160.94,16.33 165.86,16.33 166.81,17.29 175.86,17.29 176.82,16.33 180.14,16.33 180.15,16.34 193.47,16.34 | 196.98,16.34 196.99,16.33 201.1,16.33 202.06,17.29 206.47,17.29 | 206.47,17.29 210.65,17.29 212.7,19.33 216.57,19.33 | 26.42,17.34 26.63,17.29 | 62.42,17.34 62.47,17.29 | 206.42,17.34 206.47,17.29 | U$9.1 253.75,3.69 253.83,3.69 | v216.82,17.13 216.57,19.33 | PROG.1 186.37,46.29 | 186.37,46.29 186.53,46.45 186.53,47.09 186.37,47.25 U$8.8 v186.37,50.42 | C3.2 186.37,46.29 | 193.47,16.34 181.08,16.33 | U$8.27 v193.99,56.14 194.09,56.24 | C4.2 197.59,54.71 196.86,54.71 195.32,56.24 194.09,56.24 | C6.2 U$8.19 183.83,56.93 184.63,56.14 v184.94,56.14 | CN_KIJ3.5 CN_KIJ3.3 CN_KIJ3.1 CN_SYSTEM.1 | U$10.1 80.02,3.69 80.89,4.55 C16.2 | 17.05,16.34 16.96,16.6 C8.2 16.96,19.03 16.25,19.74 U$1.1 | U$2.1 52.29,19.74 52.99,19.03 C9.2 52.99,16.34
  Bottom 0.61: C10.2 88.87,17.76 | 88.87,17.76 88.87,16.34 | 88.87,17.76 88.87,19.03 88.16,19.74 U$3.1 | 125.06,16.34 C11.2 125.06,19.03 124.36,19.74 U$4.1 | U$5.1 160.24,19.74 160.94,19.03 C12.2 160.94,16.33 | 193.47,16.34 196.98,16.34 | 196.98,16.34 C13.2 196.98,19.03 196.27,19.74 U$6.1 | C18.1 123.34,52.34 122.05,53.62 IC1.1 122.21,53.62 | C19.1 C18.1 | C17.1 117.76,49.67 117.85,49.58 | 117.85,49.58 118.59,48.84 v119.22,48.84 v120.97,48.84 122.22,48.84 123.34,49.95 | 123.34,49.95 C18.1 | CN_KIJ1.1 125.31,55.43 124.29,56.46 108.74,56.46 SW16.C | 1.24,37.06 1.24,37.66 Q2.2 4.1,41.05 3.72,41.43 3.72,43.68 4.47,44.43 13.09,44.43 | 1.24,37.06 1.24,27.13 12.03,16.33 17.36,16.33 17.05,16.34 | 253.83,3.69 254.32,4.18 254.32,4.89 C15.2 | v216.82,36.86 C20.P- 211.1,39.32 R32.2 201.55,39.2 | 194.09,56.24 193.92,56.24 | 80.89,5.42 80.89,5.43 C16.2 | 117.85,50.3 117.85,50.68 117.85,49.58 | 268.98,16.34 268.98,16.33 273.1,16.33 274.08,17.31 283.88,17.31 284.85,16.33 289.08,16.33 301.47,16.34 304.98,16.34 304.98,18.93 | 266.72,16.34 265.13,17.93 259.84,17.93 258.24,16.33 248.73,16.33 247.62,17.44 238.14,17.44 237.03,16.33 233.02,16.33 233.01,16.34 C14.2 233.01,19.03 232.31,19.74 U$7.1 230.52,19.74 230.12,19.33 216.57,19.33 | 266.72,16.34 268.98,16.34 | 268.98,16.34 268.98,18.43 | 268.98,18.43 268.98,19.03 268.27,19.74 U$11.1 | 304.98,18.93 304.98,19.03 304.27,19.74 U$12.1 | 268.98,46.34 268.98,46.33 273.1,46.33 274.08,47.31 283.88,47.31 284.85,46.33 289.08,46.33 301.47,46.34 304.98,46.34 304.98,48.43 | 268.98,46.34 268.98,48.43 | 268.98,48.43 268.98,49.03 268.27,49.74 U$15.1 | 304.98,48.43 304.98,49.03 304.27,49.74 U$16.1
  Bottom 0.61: 16.98,46.43 16.98,46.34 16.98,46.33 21.11,46.33 22.06,47.29 26.47,47.29 31.86,47.29 32.82,46.33 37.08,46.33 49.47,46.34 52.98,46.34 52.98,47.82 | 16.98,46.43 16.98,48.94 | U$13.1 16.27,49.74 16.98,49.03 16.98,48.94 | U$14.1 52.27,49.74 52.98,49.03 52.98,47.82 | C24.2 17.01,48.89 16.97,48.93 16.98,48.94 | 52.98,47.82 C25.2 | C23.2 305.02,18.89 304.98,18.93 | C22.2 269.07,18.34 268.98,18.43 | C27.2 305.02,48.39 304.98,48.43 | C26.2 269.02,48.39 268.98,48.43 | 13.09,44.43 14.98,44.43 16.98,46.43 | C16.2 v82.47,5.43 | C7.2 3.97,37.06 1.24,37.06 | v177.22,46.43 v177.22,45.06 173.22,45.06 173.22,45.05 C2.2 C1.2 171.26,45.06 166.47,45.06 v163.59,47.93 v161.59,47.93 161.47,47.81 157.34,47.81 155.95,46.42 142.09,46.42 140.45,48.06 139.09,48.06 137.47,46.43 | 137.47,46.43 v135.72,48.18 | SW15.SW+ 237.26,46.33 268.97,46.33 268.98,46.34 | v266.34,8.06 259.72,8.06 258.22,6.56 258.22,3.68 256.97,2.43 255.97,2.43 254.72,3.68 253.84,3.68 253.84,3.69 253.83,3.69 | 266.09,16.93 v265.84,16.68 266.18,16.34 266.72,16.34 | R51.2 13.22,44.31 13.09,44.43 | 137.47,46.43 C5.P- | R53.2 143.21,51.76 142.32,52.65 131.02,52.65 127.97,49.6 123.69,49.6 123.34,49.95
HALACSKA1
  Bottom 0.305: 310.78,11.25 310.78,8.71 308.87,11.25 307.6,11.25 306.97,10.62 305.7,9.98 308.24,9.98 306.97,9.35 307.6,8.71 308.87,8.71 310.78,11.25
HALACSKA3
  Bottom 0.305: 161.97,66.73 161.97,63.23 164.51,66.73 166.41,66.73 167.37,66.09 167.68,65.46 169.59,64.82 165.78,64.82 167.68,64.19 167.05,63.55 166.1,62.92 164.51,62.92 161.97,66.73
HALACSKA4
  Bottom 0.305: 16.94,12.37 16.94,9.83 18.84,12.37 20.11,12.37 20.75,11.74 22.02,11.1 19.48,11.1 20.75,10.47 20.11,9.83 18.84,9.83 16.94,12.37
HALACSKA5
  Top 0.305: 125.34,66.85 125.34,63.36 122.8,66.85 120.9,66.85 119.94,66.22 119.63,65.58 117.72,64.95 121.53,64.95 119.63,64.31 120.26,63.68 121.21,63.04 122.8,63.04 125.34,66.85
HALACSKA6
  Top 0.305: 149.12,64.87 149.12,62.33 147.22,64.87 145.95,64.87 145.31,64.24 144.04,63.6 146.58,63.6 145.31,62.97 145.95,62.33 147.22,62.33 149.12,64.87
HALACSKA7
  Top 0.305: 298.25,12.5 298.25,9.96 296.34,12.5 295.07,12.5 294.44,11.86 293.17,11.23 295.71,11.23 294.44,10.59 295.07,9.96 296.34,9.96 298.25,12.5
HALACSKA8
  Top 0.305: 6.03,18.25 6.03,15.71 7.94,18.25 9.21,18.25 9.84,17.62 11.11,16.98 8.57,16.98 9.84,16.35 9.21,15.71 7.94,15.71 6.03,18.25
N$1
  Bottom 0.305: U$8.9 185.1,50.9 184.78,51.22 182.72,51.22 181.29,52.64 173.2,52.64 171.29,50.74 C1.1 171.29,46.77 Q1.2
N$2
  Bottom 0.305: U$8.10 183.83,50.58 182.4,50.58 180.97,52.01 173.67,52.01 172.89,51.22 172.89,47.57 173.2,47.25 C2.1 173.25,46.77 Q1.1
N$3
  Bottom 0.305: DL28.K 270.99,1.45 270.85,1.31 248.04,1.31 247.4,1.95 U$9.5
N$4
  Bottom 0.305: U$3.8 84.83,28.63 SW5.G2
N$5
  Bottom 0.305: DL29.K 280.24,2.85 278.07,0.68 247.4,0.68 246.13,1.95 U$9.6
N$6
  Bottom 0.305: U$10.5 71.68,1.15 71.2,0.67 41.87,0.67 39.97,2.07 24.89,2.07 22.19,4.77 22.19,4.73 DL34.K
N$7
  Bottom 0.305: SW5.P- 83.51,24.22 83.97,24.68 83.97,26.18 85.14,27.36 U$3.7
N$8
  Bottom 0.305: U$10.6 70.41,1.78 69.93,1.31 42.19,1.31 40.29,2.7 30.13,2.7 28.22,4.61 28.24,4.62 DL35.K
N$9
  Bottom 0.305: R17.2 9.65,41.78 7.27,41.78 Q2.1
N$10
  Bottom 0.305: SW6.Z- 95.97,24.64 95.97,26.68 95.29,27.36 U$3.10
N$11
  Bottom 0.305: SW5.Z- 79.93,22.68 83.97,22.68 84.97,23.68 84.97,25.43 85.62,26.09 U$3.6
N$12
  Bottom 0.305: U$3.11 94.31,26.09 94.97,25.43 94.97,23.68 95.97,22.68 100.01,22.68 SW6.P-
N$13
  Bottom 0.305: U$8.3 192.72,50.1 195.74,50.1 196.44,50.81 216.64,50.81 SW15.B
N$14
  Bottom 0.305: SW6.G2 102.78,23.49 101.22,21.93 95.72,21.93 94.28,23.37 94.28,24.37 93.83,24.82 U$3.12
N$16
  Bottom 0.305: DL14.2 244.39,28.21 R16.2
N$17  (via drill 0.6)
  Top 0.305: DPL5.K 84.4,36.18 v88.97,30.62
  Bottom 0.305: v88.97,30.62 88.97,25.18 88.6,24.82 U$3.5
N$18
  Bottom 0.305: 97.55,29.15 R6.2 100.39,28.21 DL6.2
N$19  (via drill 0.6)
  Top 0.305: v94.65,30.37 95.47,31.18 95.47,35.68 97.47,37.68 98.97,37.68 100.24,36.41 DPL6.K
  Bottom 0.305: v94.65,30.37 92.91,28.63 U$3.9
N$20
  Bottom 0.305: R5.1 82.39,29.15 DL5.2
N$21
  Bottom 0.305: U$9.15 251.21,7.02 252.16,6.07 252.27,6.07 252.45,5.89 255.41,5.89 256.38,6.86 R18.1
N$22  (via drill 0.6)
  Top 0.305: v193.99,51.22 196.37,48.84 v196.37,47.88
  Bottom 0.305: U$8.2 193.99,46.77 194.46,46.3 195.91,46.3 196.37,46.77 v196.37,47.88 | v193.99,51.22 195.9,51.22 196.1,51.42 206.2,51.42 211.51,56.72 SW15.A
N$23
  Bottom 0.305: R1.1 10.39,29.15 DL1.2
N$24  (via drill 0.6)
  Top 0.305: v22.65,30.37 24.1,31.82 24.1,35.91 24.42,36.22 24.42,36.63 25.47,37.68 26.74,37.68 DPL2.K
  Bottom 0.305: v22.65,30.37 20.91,28.63 U$1.9
N$25
  Bottom 0.305: 25.55,29.15 R2.2 28.39,28.21 DL2.2
N$26  (via drill 0.61)
  Top 0.305: v4.97,56.43 v4.97,35.18 | v287.97,58.56 v287.97,28.56
  Bottom 0.305: 26.2,31.39 21.69,31.39 21.24,31.73 17.91,31.73 17.43,32.21 9.47,32.18 8.47,31.18 8.47,29.23 R1.2 7.58,29.18 5.68,27.29 4.57,27.29 3.78,28.08 3.78,34 v4.96,35.18 v4.97,35.18 4.97,38.06 5.47,38.56 7.74,38.56 8.22,39.07 R26.1 | 26.2,31.39 32.33,31.39 32.67,31.73 39.34,31.73 39.66,31.42 44.42,31.42 | 44.42,31.42 50.29,31.42 50.77,31.89 57.28,31.89 57.78,31.39 61.56,31.39 | 80.47,31.39 75.85,31.42 75.37,31.89 68.71,31.89 68.2,31.39 61.56,31.39 | 80.47,31.39 86.3,31.39 86.65,31.73 93.31,31.73 93.63,31.42 99.47,31.39 | 99.47,31.39 104.27,31.42 104.59,31.73 111.25,31.73 111.6,31.39 116.31,31.39 | 116.31,31.39 122.37,31.42 122.68,31.73 129.35,31.73 129.69,31.39 133.48,31.39 | 133.48,31.39 140.28,31.39 140.62,31.73 147.29,31.73 147.61,31.42 152.6,31.42 | 152.63,31.39 152.69,31.42 | 152.69,31.42 158.24,31.42 158.56,31.73 165.39,31.73 165.7,31.42 167.29,31.42 167.79,30.91 169.52,30.91 | 169.52,30.91 174.94,30.91 177.29,28.56 182.69,28.56 185.55,31.42 188.56,31.42 | R2.1 25.51,31.34 26.2,31.39 | R3.2 44.51,31.35 44.42,31.42 | R5.2 80.51,31.34 80.47,31.39 | R7.2 116.52,31.34 116.31,31.39 | R11.2 152.52,31.34 152.63,31.39 | R15.2 224.52,31.5 224.6,31.73 | R13.2 188.56,29.18 188.56,31.42 | 188.56,31.42 194.28,31.42 194.75,31.89 201.26,31.89 201.74,31.42 205.61,31.42 | 224.6,31.73 222.06,31.73 221.58,31.26 219.84,31.26 219.36,31.73 207.57,31.73 207.25,31.42 205.61,31.42 | 224.6,31.73 240.79,31.73 241.52,30.85 241.52,30.81 | R16.1 241.52,30.81 | 152.6,31.42 152.69,31.42 | 152.63,31.39 152.6,31.42 | 61.56,31.39 61.56,29.19 R4.1 | 99.47,31.39 97.6,31.39 97.6,29.18 R6.1 | 133.48,31.39 133.48,29.18 R8.1
  Bottom 0.305: 169.52,30.91 R12.1 | R14.1 205.55,29.19 205.55,31.39 205.59,31.43 205.61,31.42 | R33.2 260.56,29.18 260.56,31.42 | 260.56,31.42 266.28,31.42 266.76,31.89 273.26,31.89 273.74,31.42 277.55,31.42 | 277.55,31.42 277.55,29.31 | 277.55,29.31 277.55,29.19 277.52,29.19 277.52,29.18 | 260.56,31.42 257.55,31.42 254.69,28.56 249.09,28.56 246.84,30.81 241.52,30.81 | 277.55,31.42 277.73,31.42 278.22,30.93 282.72,30.93 282.73,30.92 | R42.2 44.56,59.18 44.56,61.42 | 44.56,61.42 50.28,61.42 50.75,61.89 57.26,61.89 57.74,61.42 61.55,61.42 61.55,59.19 R43.1 | 44.56,61.42 41.55,61.42 38.69,58.56 33.09,58.56 30.73,60.92 | R45.2 260.56,59.18 260.56,61.42 266.28,61.42 266.76,61.89 273.26,61.89 273.74,61.42 277.55,61.42 | 277.55,61.42 277.55,59.19 R46.1 | 277.55,61.42 277.73,61.42 278.22,60.93 282.72,60.93 285.09,58.56 v287.97,58.56 290.69,58.56 293.55,61.42 296.56,61.42 | 25.55,61.42 21.74,61.42 21.39,61.77 14.63,61.77 14.28,61.42 8.56,61.42 8.56,59.18 R39.2 7.72,59.18 v4.97,56.43 | 25.55,61.42 25.55,59.19 R40.1 | 25.55,61.42 25.73,61.42 26.22,60.93 30.72,60.93 30.73,60.92 | R36.2 296.56,29.18 296.56,31.42 | 296.56,31.42 302.28,31.42 302.76,31.89 309.26,31.89 309.74,31.42 313.55,31.42 313.55,29.19 R37.1 | 296.56,31.42 293.55,31.42 290.69,28.56 v287.97,28.56 285.09,28.56 282.73,30.92 | R48.2 296.56,59.18 296.56,61.42 | 296.56,61.42 302.28,61.42 302.76,61.89 309.26,61.89 309.74,61.42 313.55,61.42 313.55,59.19 R49.1 | 30.7,60.92 30.73,60.92 | R34.1 277.67,29.18 277.55,29.31 | 282.7,30.92 282.73,30.92
N$27
  Bottom 0.305: SW3.P- 47.51,24.22 47.97,24.68 47.97,26.18 49.14,27.36 U$2.7
N$28
  Bottom 0.305: SW3.Z- 43.93,22.68 47.97,22.68 48.97,23.68 48.97,25.43 49.62,26.09 U$2.6
N$29
  Bottom 0.305: SW1.P- 11.51,24.22 11.97,24.68 11.97,26.18 13.14,27.36 U$1.7
N$30
  Bottom 0.305: SW1.Z- 7.93,22.68 11.97,22.68 12.97,23.68 12.97,25.43 13.62,26.09 U$1.6
N$31
  Bottom 0.305: SW2.Z- 23.97,24.64 23.97,26.68 23.29,27.36 U$1.10
N$32
  Bottom 0.305: U$1.11 22.31,26.09 22.97,25.43 22.97,23.68 23.97,22.68 28.01,22.68 SW2.P-
N$33  (via drill 0.61)
  Top 0.305: v107.34,49.31 105.84,47.81 105.84,37.56 v105.78,37.49 | v190.07,52.05 192.45,52.05 194.52,54.11 198.33,54.11 198.96,54.74 200.23,54.74 201.5,53.47 201.5,49.03 202.77,47.76 v203.41,47.76
  Bottom 0.305: U$8.6 188.83,48.66 188.83,51.85 188.8,51.89 | 188.8,51.89 188.28,52.49 183.36,52.49 181.93,53.92 172.24,53.92 170.5,52.17 151.13,52.17 148.84,49.88 142.94,49.88 141.6,51.22 131.86,51.22 127.57,46.93 123.48,46.93 123.35,46.93 109.59,46.93 107.34,49.18 v107.34,49.31 | v105.78,37.49 42.99,37.49 41.24,35.75 30.77,35.75 26.96,39.56 25.21,39.56 20.84,43.93 16.84,43.93 15.72,42.81 10.52,42.81 R17.1 | v190.07,52.05 188.64,52.05 188.8,51.89 | v203.41,47.76 R52.1 | 188.8,51.89
N$34
  Top 0.305: 163.22,36.18 DL15.K
  Bottom 0.305: R28.1 195.73,37.9 164.01,37.9 163.24,37.12 DL15.K
N$35
  Top 0.305: CN_KIJ3.8 168.59,57.96 168.59,55.45 CN_KIJ3.7
  Bottom 0.305: R30.1 158.12,60.42 158.76,61.07 165.45,61.07 168.56,57.95 168.59,57.95 | 168.59,57.95 170.28,57.95 173.46,61.26 181.9,61.26 182.57,60.6 182.57,57.98 U$8.18 | 168.59,57.95 CN_KIJ3.8
N$36  (via drill 0.6)
  Top 0.305: CN_KIJ3.6 167.32,56.72 167.32,54.87 168.12,54.07 169.07,54.07 171.93,56.93 171.93,58.2 v172.56,58.84
  Bottom 0.305: U$8.17 181.29,59.95 180.63,60.61 174.34,60.61 v172.56,58.84 | CN_KIJ3.6 166.07,58.12 164.36,59.82 R29.1
N$37
  Bottom 0.305: U$10.15 75.49,7.97 76.12,7.34 R10.1
N$38
  Bottom 0.305: U$10.7 69.14,2.42 68.66,1.94 42.5,1.94 40.61,3.34 35.58,3.34 DL36.K
N$39
  Bottom 0.305: U$10.8 67.87,3.58 66.97,2.68 42.73,2.69 DL37.K
N$40
  Bottom 0.305: U$10.9 58.41,9.08 58.34,9.06 58.09,9.06 54.34,5.31 54.34,5.01 52.67,3.34 47.58,3.34 DL38.K
N$41  (via drill 0.6)
  Top 0.305: v197.8,47.88 196.15,46.29 194.15,46.29 192.25,44.39 PROG.3
  Bottom 0.305: U$8.1 195.26,48.52 196.22,49.47 197.64,49.47 | v197.8,47.88 197.64,47.72 197.64,49.31
  Bottom 0.61: 197.64,49.56 R9.1 197.65,49.48 197.64,49.47 | 197.64,49.56 197.64,49.47 | 197.64,49.47 197.64,49.31 | 197.64,49.56 197.64,49.63
N$42
  Top 0.305: CN_SYSTEM.15 CN_SYSTEM.16
N$43
  Bottom 0.305: SW2.G2 30.78,23.49 29.22,21.93 23.72,21.93 22.28,23.37 22.28,24.37 21.83,24.82 U$1.12
N$44
  Top 0.305: CN_SYSTEM.17 CN_SYSTEM.18
N$45
  Top 0.305: CN_SYSTEM.19 CN_SYSTEM.20
N$46
  Bottom 0.305: U$10.10 69.14,10.35 68.66,10.83 66.36,10.83 65.47,9.93 57.47,9.93 57.39,9.83 DL39.K
N$47  (via drill 0.61)
  Top 0.305: v244.97,1.81 245.47,1.31 282.97,1.31 286.24,4.58 DL30.K
  Bottom 0.305: U$9.7 244.86,1.91 v244.97,1.81
N$48  (via drill 0.61)
  Top 0.305: v243.59,1.56 244.34,0.68 288.22,0.68 292.16,4.62 | 292.16,4.62 292.22,4.68 | DL31.K 292.17,4.62 292.16,4.62
  Bottom 0.305: U$9.8 v243.59,1.56
N$49
  Bottom 0.305: DL32.K 298.24,5.11 296.92,6.58 278.69,6.58 275.09,10.18 265.84,10.18 265.59,10.43 264.47,10.43 264.22,10.18 255.34,10.18 253.68,11.84 245.23,11.84 243.59,10.19 U$9.9
N$50
  Bottom 0.305: U$1.8 12.83,28.63 SW1.G2
N$51  (via drill 0.61)
  Top 0.305: v242.59,11.68 242.84,11.93 246.62,11.93 247.12,12.43 255.84,12.43 v256.97,11.31
  Bottom 0.305: U$9.10 244.86,7.81 244.54,7.5 243.11,7.5 242.72,7.89 242.72,11.56 v242.59,11.68 | DL33.K 301.49,7.43 278.97,7.31 274.47,11.81 257.47,11.81 v256.97,11.31
N$52  (via drill 0.61)
  Top 0.305: DPL16.K 215.49,55.43 236.22,55.43 236.97,54.68 236.97,45.93 251.09,31.81 251.09,18.31 254.09,15.31 256.22,15.31 259.34,12.18 | v246.09,10.68 246.11,10.7 246.33,10.7 247.45,11.81 254.97,11.81 256.59,10.18 257.34,10.18 259.34,12.18 | DPL31.K 262.24,9.29 259.34,12.18
  Bottom 0.305: U$9.11 246.13,10.65 v246.09,10.68
N$53  (via drill 0.61)
  Top 0.305: v254.21,2.44 248.71,2.43 246.84,2.43 241.97,7.18 237.22,7.18 229.47,14.93 225.09,14.93 222.97,12.81 216.09,12.81 214.72,14.18 214.72,33.93 215.84,35.06 215.84,39.93 212.97,42.81 212.97,54.81 v207.47,60.31
  Bottom 0.305: U$9.2 251.21,2.31 251.58,1.94 253.72,1.93 v254.21,2.43 v254.21,2.44 | 187.59,57.65 187.66,59.25 187.66,59.87 188.1,60.31 v207.47,60.31 | 187.59,57.65 187.59,57.93 | U$8.22 187.59,57.65
N$54
  Bottom 0.305: U$9.14 249.94,7.97 249.15,7.18 248.28,7.18 246.54,5.43 242.59,5.43 241.59,6.43 226.84,6.43 224.22,9.06 224.22,11.43 223.84,11.81 100.18,11.81 99.72,11.34 99.72,8.31 93.34,1.93 76.22,1.93 75.47,2.68 75.47,3.67 U$10.2
N$55  (via drill 0.61)
  Top 0.305: DPL15.K 238.22,54.16 238.22,46.31 252.84,31.68 252.84,17.81 254.47,16.18 256.74,16.18 266.1,6.82 | 266.1,6.82 DPL32.K | v246.34,6.81 246.34,6.06 247.59,4.81 258.09,4.81 259.22,5.93 260.22,5.93 260.97,5.18 260.97,4.18 261.72,3.43 262.72,3.43 266.1,6.82
  Bottom 0.305: U$9.12 247.4,7.97 246.34,6.91 v246.34,6.81
N$56
  Bottom 0.305: U$8.7 187.64,51.3 187.09,51.85 183.04,51.85 181.61,53.28 172.56,53.28 170.81,51.53 151.45,51.53 149.16,49.25 142.62,49.25 141.29,50.58 132.18,50.58 127.89,46.29 108.73,46.29 104.97,50.06 104.97,55.18 106.47,56.68 | 106.93,57.2 106.93,57.14 106.47,56.68 | 106.47,56.68 SW16.B
N$57
  Bottom 0.305: U$8.5 190.1,48.66 190.07,50.62 191.06,51.6 191.06,52.57 190.5,53.12 183.67,53.12 182.25,54.55 171.93,54.55 170.18,52.8 150.81,52.8 148.53,50.52 143.26,50.52 141.92,51.85 131.54,51.85 127.25,47.57 110.59,47.57 106.47,51.68 SW16.A
N$58  (via drill 0.6)
  Top 0.305: v16.97,30.93 15.99,31.91 15.98,31.91 12.71,36.18 DPL1.K
  Bottom 0.305: v16.97,30.93 16.97,25.18 16.6,24.82 U$1.5
N$59
  Bottom 0.305: SW4.Z- 59.97,24.64 59.97,26.68 59.29,27.36 U$2.10
N$60
  Bottom 0.305: U$8.4 191.45,51.06 192.57,52.18 194.41,52.18 194.7,51.89 195.63,51.89 195.95,52.2 195.96,52.18 205.72,52.18 211.59,58.06 217.97,58.06 219.3,56.72 SW15.SW-
N$61  (via drill 0.6)
  Top 0.305: v174,50.9 170.66,50.9 v170.18,50.42
  Bottom 0.305: U$8.11 182.56,49.63 182.4,49.79 182.25,49.79 180.66,51.38 174.63,51.38 v174,50.9 | v170.18,50.42 169.7,50.9 151.77,50.9 149.48,48.61 142.3,48.61 140.97,49.95 132.49,49.95 128.21,45.66 108.24,45.66 102.26,51.64 SW16.SW-
N$62
  Bottom 0.61: C6.1 185.1,59.76 U$8.20
N$63
  Bottom 0.305: U$2.2 23.71,20.96 22.44,22.23 U$1.14
N$64
  Bottom 0.305: U$2.11 58.31,26.09 58.97,25.43 58.97,23.68 59.97,22.68 64.01,22.68 SW4.P-
N$65
  Bottom 0.305: SW4.G2 66.78,23.49 65.22,21.93 59.72,21.93 58.28,23.37 58.28,24.37 57.83,24.82 U$2.12
N$66
  Bottom 0.305: U$2.8 48.83,28.63 SW3.G2
N$67  (via drill 0.6)
  Top 0.305: DPL3.K 48.56,36.18 v52.97,30.77
  Bottom 0.305: v52.97,30.77 52.97,25.18 52.6,24.82 U$2.5
N$68  (via drill 0.61)
  Top 0.305: DPL34.K 64.24,11.16 v64.22,11.18 | DPL17.K 112.24,54.29 111.09,55.43 109.22,55.43 107.97,54.18 107.97,53.68 107.22,52.93 93.97,52.93 88.47,58.43 76.72,58.43 71.59,53.31 71.59,14.93 69.34,12.68 69.34,10.18 69.97,9.56 70.97,9.56 71.72,10.31 v71.72,11.43
  Bottom 0.305: U$10.12 71.68,11.4 v71.72,11.43 71.34,11.81 66.09,11.81 65.47,11.18 v64.22,11.18
N$69  (via drill 0.61)
  Top 0.305: DPL18.K 86.85,55.57 86.59,55.56 85.09,55.56 78.47,48.93 78.47,38.93 72.22,32.68 72.22,14.31 70.47,12.56 v70.47,10.68
  Bottom 0.305: U$10.11 70.41,7.45 69.89,6.93 60.49,6.93 DPL33.K | U$10.11 | U$10.11 70.47,9.14 v70.47,10.68
N$70
  Bottom 0.305: SW7.P- 119.51,24.22 119.97,24.68 119.97,26.18 121.14,27.36 U$4.7
N$71
  Bottom 0.305: R26.2 Q2.3
N$72  (via drill 0.6)
  Top 0.305: v177.5,49.73 176.1,48.2 v176.1,39.19
  Bottom 0.305: U$8.12 181.31,48.6 181.31,49.6 180.67,50.24 178.01,50.24 v177.5,49.73 | v176.1,39.19 176.19,39.27 R28.2 197.02,39.22 R31.1
N$73  (via drill 0.6, 0.61)
  Top 0.305: v30.11,12.99 30.11,17.35 v27.77,19.68 32.59,24.5 32.59,29.03 30.69,30.93 30.69,47.44 28.45,49.68 v27.77,49.68 | v99.8,19.68 101.98,17.51 v101.98,12.84 101.87,12.84 101.59,12.56 100.59,12.56 99.72,11.68 99.72,9.43 97.47,7.18 94.47,7.18 v90.59,11.06 | v171.83,19.68 174.17,17.35 v174.17,12.99 | v135.9,19.68 137.45,18.13 v137.45,12.99 | C20.P+ 211.01,32.15 212.13,31.04 212.13,24.82 207.77,20.46 v207.77,19.68 209.79,17.66 v209.79,12.99 209.84,13.04 209.84,13.06 210.72,12.18 223.72,12.18 224.22,11.68 224.22,9.68 226.47,7.43 v234.97,7.43 | v279.77,19.68 281.79,17.66 v281.79,12.99 | v243.65,19.67 246.18,17.14 246.18,13.03 arc-90 246.15,13 v246.19,13 | v317.79,12.99 317.79,17.66 v315.77,19.68 315.77,19.61 | v279.77,49.68 281.79,47.66 v281.79,42.99 | v315.77,49.68 320.04,45.41 v320.04,40.74 320.04,40.73 320.09,40.68 | v67.12,5.73 66.2,6.65 v66.2,12.99 66.2,17.19 v63.71,19.68 v63.72,19.68 63.72,20.43 68.09,24.81 68.09,45.36 v63.77,49.68 | 319.84,40.68 320.09,40.68 | 320.09,40.68 320.09,23.93 315.77,19.61 | v238.34,8.81 239.22,7.93 242.84,7.93 247.22,3.68 256.38,3.68 v256.41,3.71 | 315.72,19.56 315.77,19.61